# Altium schematic sheet Accelerometer.SchDoc
size 420 x 297 mm
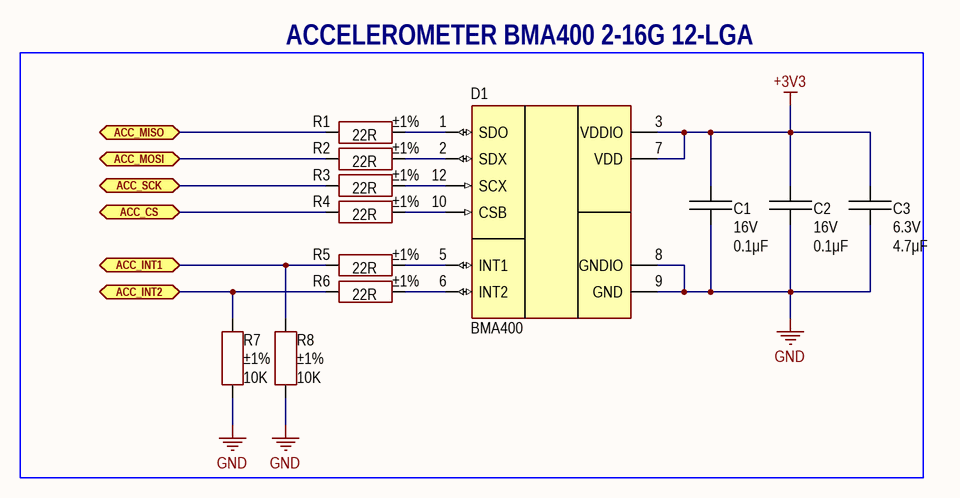
[diagram p0: Accelerometer.SchDoc]

## Parts
C1  value 0.1μF  Voltage: 16V  [CAP: 0402_NO_SILK]
C2  value 0.1μF  Voltage: 16V  [CAP: 0402_NO_SILK]
C3  value 4.7μF  Voltage: 6.3V  [CAP: 0603_NO_SILK]
D1  (no value)  [12-VFLGA]
R1  value 22R  Tolerance: ±1%  [RES: 0201]
R2  value 22R  Tolerance: ±1%  [RES: 0201]
R3  value 22R  Tolerance: ±1%  [RES: 0201]
R4  value 22R  Tolerance: ±1%  [RES: 0201]
R5  value 22R  Tolerance: ±1%  [RES: 0201]
R6  value 22R  Tolerance: ±1%  [RES: 0201]
R7  value 10K  Tolerance: ±1%  [RES: 0201]
R8  value 10K  Tolerance: ±1%  [RES: 0201]

## Blocks framed on the sheet
ACCELEROMETER BMA400 2-16G 12-LGA: C1-C3 D1 R1-R8

## Ports
ACC_CS (bidir), ACC_INT1 (bidir), ACC_INT2 (bidir), ACC_MISO (bidir), ACC_MOSI (bidir), ACC_SCK (bidir)

## Nets
+3V3: C1.2 C2.2 C3.2 D1.3(VDDIO) D1.7(VDD)
GND: C1.1 C2.1 C3.1 D1.8(GNDIO) D1.9(GND) R7.1 R8.1
ACC_CS: R4.2 ; port ACC_CS
ACC_INT1: R5.2 R8.2 ; port ACC_INT1
ACC_INT2: R6.2 R7.2 ; port ACC_INT2
ACC_MISO: R1.2 ; port ACC_MISO
ACC_MOSI: R2.2 ; port ACC_MOSI
ACC_SCK: R3.2 ; port ACC_SCK
NetD1_1: D1.1(SDO) R1.1
NetD1_2: D1.2(SDX) R2.1
NetD1_5: D1.5(INT1) R5.1
NetD1_6: D1.6(INT2) R6.1
NetD1_10: D1.10(CSB) R4.1
NetD1_12: D1.12(SCX) R3.1

## Notes on the sheet
- Author
- Manufacturer
- Date
- Page
- Total pages
- Size page
- A3
- Materials

## Library data of the parts
C1 C2 = Ceramic_0402: 0.1 µF ±10% 16V Ceramic Capacitor X7R 0402 (1005 Metric); Manufacturer: Yageo; PartNumber: CC0402KRX7R7BB104; ValueManufacturerPartNumber: Ceramic capacitor, 0.1μF, X7R, ±10%, 16V, 0402, -55...+125°C; Package: 0402; HelpURL: https://www.digikey.com/product-detail/en/yageo/CC0402KRX7R7BB104/311-1338-1-ND/2103122; Temperature: -55...+125°C; TypeCapacitor: Ceramic capacitor; Tolerance: ±10%; TypeDielectric: X7R
C3 = Ceramic_0603: 4.7 µF ±20% 6.3V Ceramic Capacitor X7R 0603 (1608 Metric); Manufacturer: Yageo; PartNumber: CC0603MRX7R5BB475; ValueManufacturerPartNumber: Ceramic capacitor, 4.7μF, X7R, ±10%, 6.3V, 0603, -55...+125°C; Tolerance: ±10%; Package: 0603; HelpURL: https://www.digikey.com/en/products/detail/yageo/CC0603MRX7R5BB475/7164380; Temperature: -55...+125°C; TypeCapacitor: Ceramic capacitor; TypeDielectric: X7R
D1 = BMA400: Accelerometer; Manufacturer: Bosch Sensortec; Supply: 1.72...3.6V; Sensing: Digital sensor; HelpURL: https://www.digikey.com/en/products/detail/bosch-sensortec/BMA400/8634941; Package: 12-VFLGA; ComponentType: IC accelerometer; ValueManufacturerPartNumber: =ComponentType+', '+Sensing+', '+Accuracy+', '+GainBandwidth+', '+Sensitivity+', '+Temperature+', '+Package; Temperature: -40...+85°C; PartNumber: BMA400
R1-R6 = Resistor_0201: 22 Ohms ±1% 0.05W, 1/20W Chip Resistor 0201 (0603 Metric) Moisture Resistant Thick Film; Manufacturer: Yageo; PartNumber: RC0201FR-0722RL; ValueManufacturerPartNumber: Resistor film, 22R, ±1%, 0201, 0.05W, -55...+125°C; TypeResistor: Resistor film; Package: 0201; HelpURL: https://www.digikey.com/en/products/detail/yageo/RC0201FR-0722RL/5280378; Temperature: -55...+125°C; Power: 0.05W
R7 R8 = Resistor_0201: 10 kOhms ±1% 0.05W, 1/20W Chip Resistor 0201 (0603 Metric) Moisture Resistant Thick Film; Manufacturer: Yageo; PartNumber: RC0201JR-0710KL; ValueManufacturerPartNumber: Resistor film, 10K, ±1%, 0201, 0.05W, -55...+125°C; TypeResistor: Resistor film; Package: 0201; HelpURL: https://www.digikey.com/en/products/detail/yageo/RC0201FR-0710KL/1948870; Temperature: -55...+125°C; Power: 0.05W